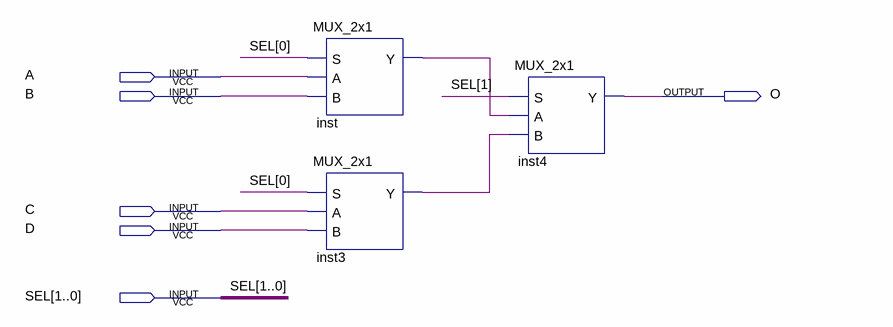
[diagram p0: schematic sheet]
// Quartus schematic MUX_4x1.bdf as structural Verilog: 3 symbols, 6 pins
module MUX_4x1 (
  input  A,
  input  B,
  input  C,
  input  D,
  input  [1:0] SEL,
  output O
);

  wire inst3_y, inst_y;

  MUX_2x1 inst (.S(SEL[0]), .A(A), .B(B), .Y(inst_y));
  MUX_2x1 inst3 (.S(SEL[0]), .A(C), .B(D), .Y(inst3_y));
  MUX_2x1 inst4 (.S(SEL[1]), .A(inst_y), .B(inst3_y), .Y(O));
endmodule
